# Altium schematic sheet Input_Fuses.SchDoc
size 199 x 250 mm; DocumentNumber: 4; SheetNumber: 4; SheetTotal: 11
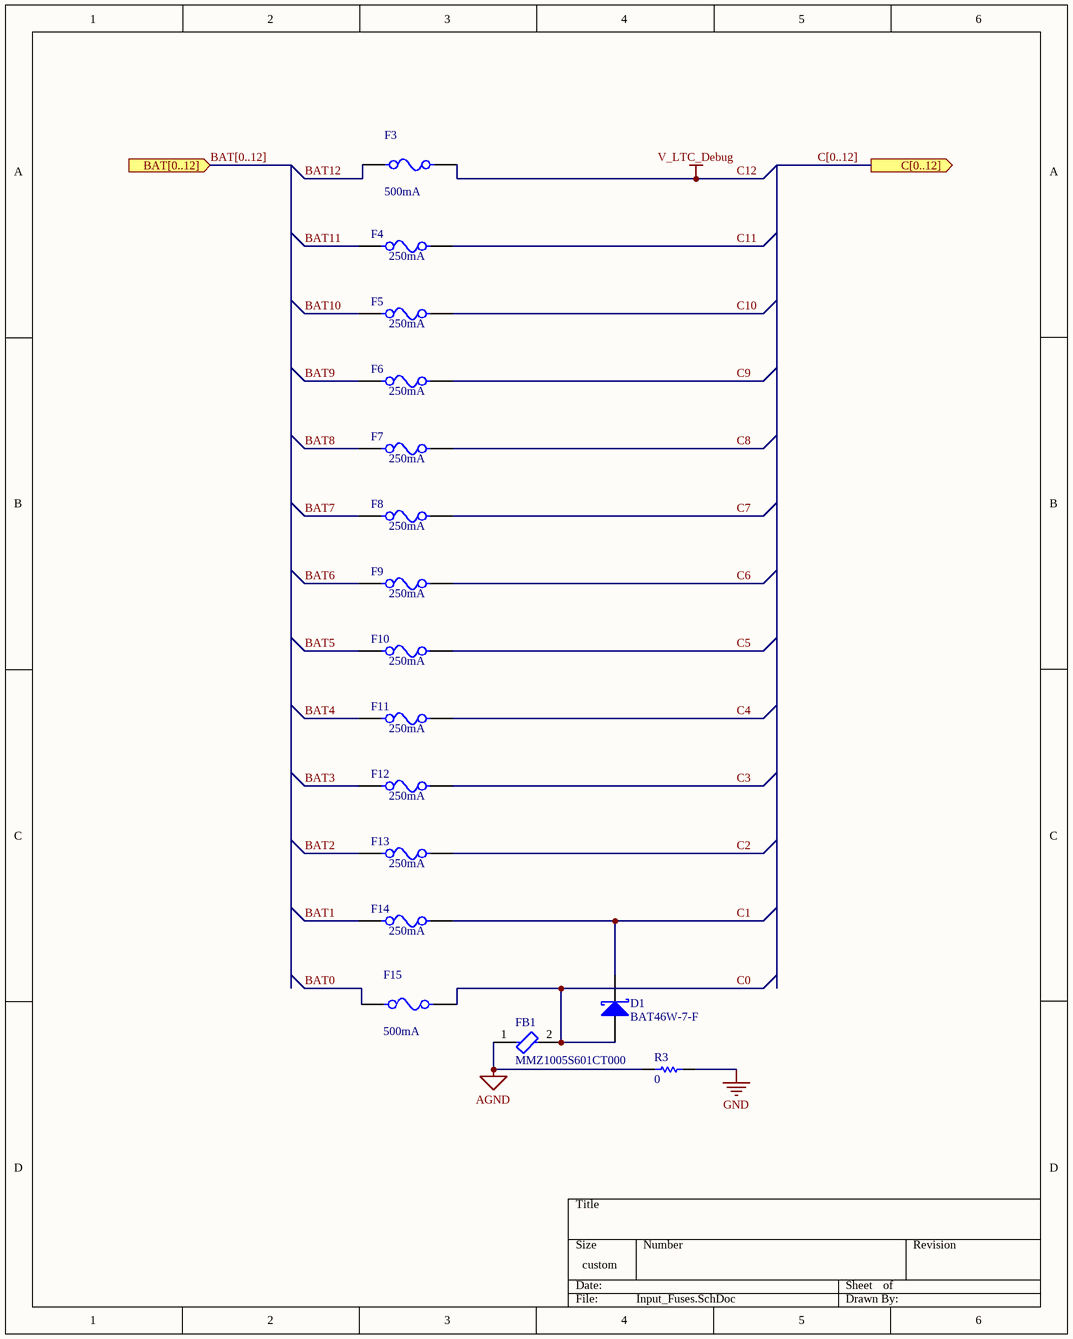
[diagram p0: Input_Fuses.SchDoc]

## Parts
D1  BAT46W-7-F  [DIOD-SOD-123-2_V]
F3  500mA  [Fuse_500_mA]
F4  250mA  [RESC0603(1608)_N]
F5  250mA  [RESC0603(1608)_N]
F6  250mA  [RESC0603(1608)_N]
F7  250mA  [RESC0603(1608)_N]
F8  250mA  [RESC0603(1608)_N]
F9  250mA  [RESC0603(1608)_N]
F10  250mA  [RESC0603(1608)_N]
F11  250mA  [RESC0603(1608)_N]
F12  250mA  [RESC0603(1608)_N]
F13  250mA  [RESC0603(1608)_N]
F14  250mA  [RESC0603(1608)_N]
F15  500mA  [Fuse_500_mA]
FB1  MMZ1005S601CT000  [FP-MMZ1005-MFG]
R3  0  [RESC0603(1608)_N]

## Ports
BAT[0..12] (in), C[0..12] (out)

## Nets
AGND: FB1.1 R3.2
C12: F3.1  [also labelled V_LTC_Debug]
GND: R3.1
BAT0: F15.2
BAT1: F14.1
BAT2: F13.1
BAT3: F12.1
BAT4: F11.1
BAT5: F10.1
BAT6: F9.1
BAT7: F8.1
BAT8: F7.1
BAT9: F6.1
BAT10: F5.1
BAT11: F4.1
BAT12: F3.2
C0: D1.1(A) F15.1 FB1.2
C1: D1.2(K) F14.2
C2: F13.2
C3: F12.2
C4: F11.2
C5: F10.2
C6: F9.2
C7: F8.2
C8: F7.2
C9: F6.2
C10: F5.2
C11: F4.2

## Buses and harness runs
bus BAT[0..12] = port BAT[0..12]
bus C[0..12] = port C[0..12]

## Library data of the parts
D1 = CMP-0303-00004-1: Surface Mount Schottky Barrier Diode, 100 V, -55 to 125 degC, 2-Pin SOD123, RoHS, Tape and Reel; Manufacturer: Diodes Inc; IR@1.5 V: 0.3 uA Max.; V(BR)R: 100 V Min.; VF@10 mA: 0.45 V Max.; CT@1 V: 12 pF Typ.; PartNumber: BAT46W-7-F; ComponentLink1URL: http://www.diodes.com/; ComponentLink3URL: http://diodes.com/datasheets/ds30044.pdf; PackageDescription: 2-Pin SMD, Body 2.7 x 1.55 mm, Height 1.45 mm; ComponentLink2Description: Datasheet; ComponentLink3Description: Package Specification; Mounting Technology: Surface Mount; ComponentLink1Description: Manufacturer URL; RoHS: TRUE; Operating Temperature: -55 to 125 degC; Packing: Tape and Reel; ComponentLink2URL: http://diodes.com/datasheets/ds30044.pdf; DatasheetVersion: Rev. 16-2
F3 F15 = Fuse_500mA: 0679H0500-01, Sicherungen zur Aufbaumontage 500mA 350 VAC 72 VCD; Voltage_Rating: 72 VDC; Value: 500mA; OC_Mouser: 530-0679H0500-01
F4-F14 = Bel Fuse C2Q250: Fuse, Fast Blow 250mA, 63VDC; Voltage Rating AC: 32V; Voltage Rating DC: 63; OC_Mouser: 530-C2Q250; Value: 250mA; PackageReference: 0603; Manufacturer: Bel Fuse; Characteristic: Fast Blow
FB1 = CMP-08257-000098-1: Signal Line Ferrite Bead 600Ω @ 100MHz 300mA DCR 520mΩ SMD 0402; Tolerance: 25%; Impedance: 600R; DC Resistance (DCR): 600mR; Height: 0.022inch; Series: MMZ; Case Code (Metric): 1005; Case Code (Imperial): 0402; Length: 0.039inch; RoHS Compliant: Yes; Package Quantity: 10000; Case/Package: 0402; Packaging: Cut Tape; Current Rating: 300mA; Max DC Current: 300mA; Width: 0.02inch; Core Material: Ferrite; Lead Free: Lead Free; REACH SVHC: No SVHC; Mount: Surface Mount
R3 = Res 0R: Chipwiderstand, SMD, Baureihe MC, 1%; Manufacturer: Multicomp; Value: 0R; Power: 100mW; PackageReference: 0603; OC_FARNELL: 9331662